# Altium schematic sheet Lilypad_Schematic_1.SchDoc
size A4
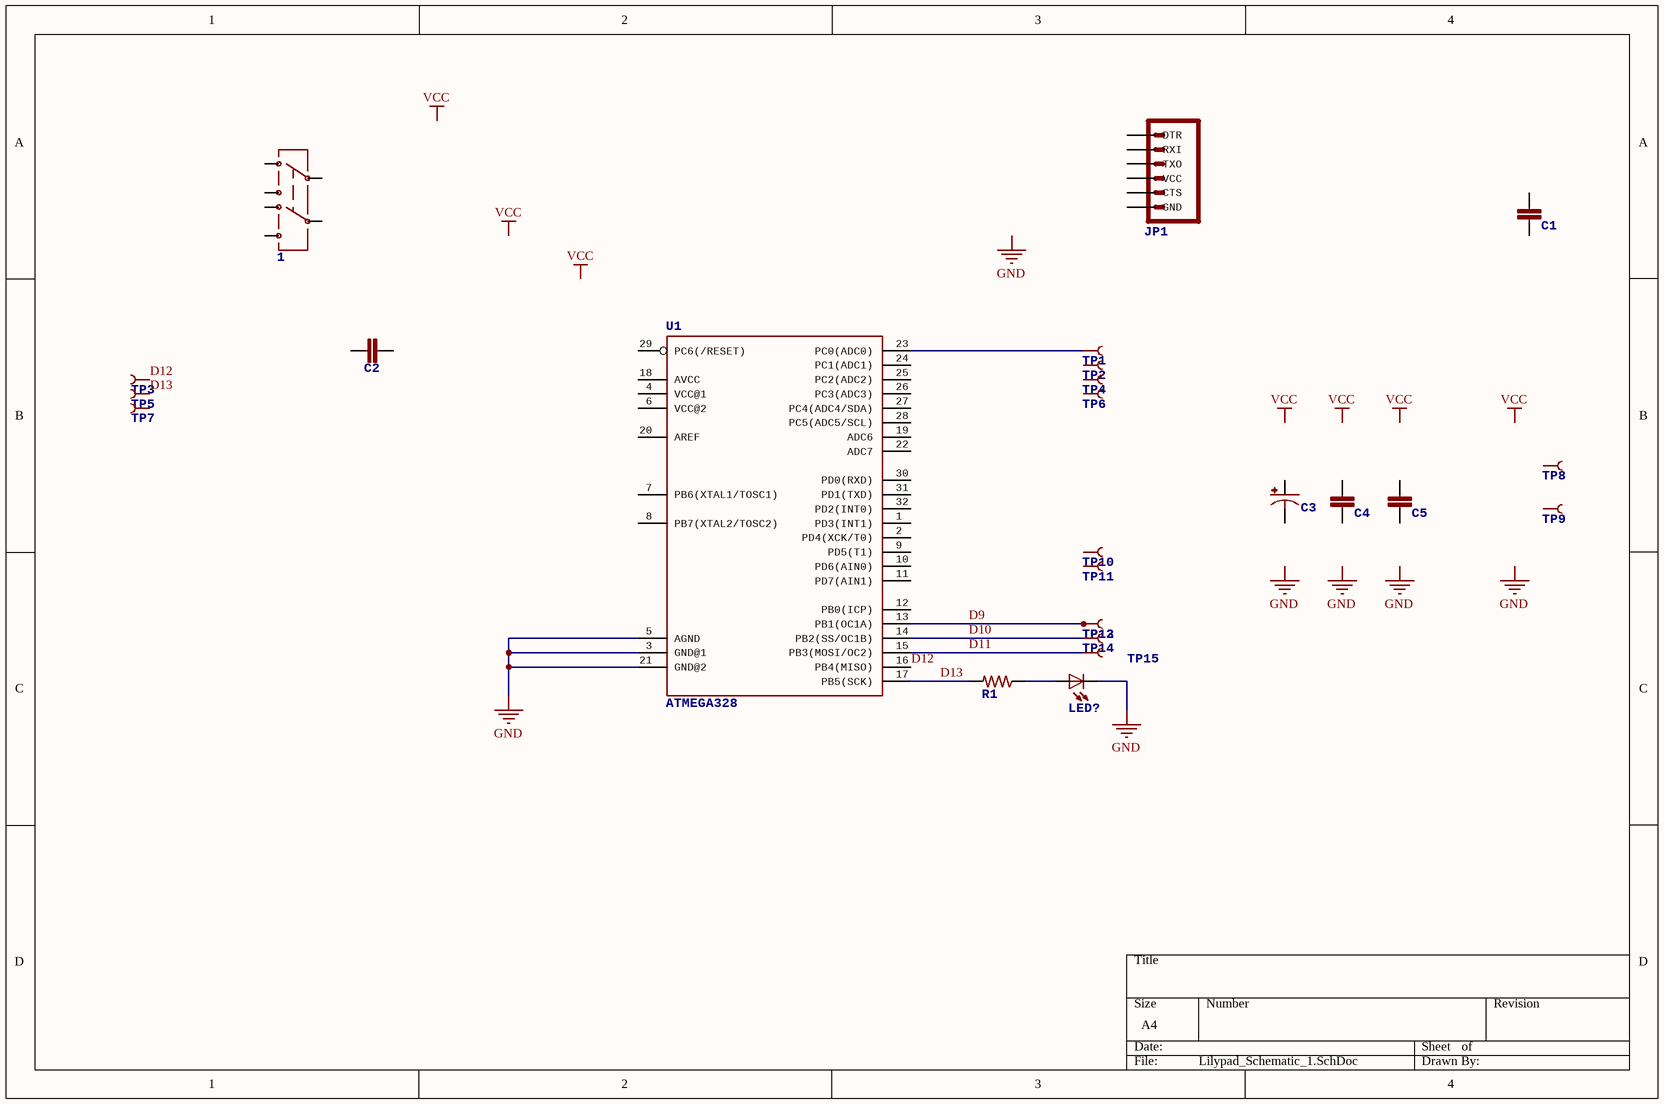
[diagram p0: Lilypad_Schematic_1.SchDoc]

## Parts
1  AYZ0202  [AYZ0202]  (value not drawn)
C1  CAP0402-CAP  [0402-CAP]  (value not drawn)
C2  CAP0402-CAP  [0402-CAP]  (value not drawn)
C3  CAP_POL3528  [EIA3528]  (value not drawn)
C4  CAP0402-CAP  [0402-CAP]  (value not drawn)
C5  CAP0402-CAP  [0402-CAP]  (value not drawn)
JP1  ARDUINO_SERIAL_PROGRAMSMD  [1X06-SMD]  (value not drawn)
LED?  LED0603  [LED-0603]  (value not drawn)
R1  RESISTOR0402-RES  [0402-RES]  (value not drawn)
TP1  CONN  [PETAL-LONG-2]  (value not drawn)
TP2  CONN  [PETAL-LONG-2]  (value not drawn)
TP3  CONN  [PETAL-LONG-2]  (value not drawn)
TP4  CONN  [PETAL-LONG-2]  (value not drawn)
TP5  CONN  [PETAL-LONG-2]  (value not drawn)
TP6  CONN  [PETAL-LONG-2]  (value not drawn)
TP7  CONN  [PETAL-LONG-2]  (value not drawn)
TP8  CONN  [PETAL-LONG-2]  (value not drawn)
TP9  CONN  [PETAL-LONG-2]  (value not drawn)
TP10  CONN  [PETAL-LONG-2]  (value not drawn)
TP11  CONN  [PETAL-LONG-2]  (value not drawn)
TP12  CONN  [PETAL-LONG-2]  (value not drawn)
TP13  CONN  [PETAL-LONG-2]  (value not drawn)
TP14  CONN  [PETAL-LONG-2]  (value not drawn)
TP15  CONN  [PETAL-LONG-2]  (value not drawn)
U1  ATMEGA328  [TQFP32-08]

## Nets
GND: LED?.C U1.3(GND@1) U1.5(AGND) U1.21(GND@2)
D9: TP12.1 TP13.1 U1.13(PB1(OC1A))
D10: TP14.1 U1.14(PB2(SS/OC1B))
D11: TP15.1 U1.15(PB3(MOSI/OC2))
D12: TP3.1 U1.16(PB4(MISO))
D13: R1.2 TP5.1 U1.17(PB5(SCK))
NetLED?_A: LED?.A R1.1
NetTP1_1: TP1.1 U1.23(PC0(ADC0))

Not connected (* = marked no-connect by the designer): 1 1(3) 2 3(1) 4(6) 5 6(4); C1 1 2; C2 1 2; C3 A(+) C(-); C4 1 2; C5 1 2; JP1 1(DTR) 2(RXI) 3(TXO) 4(VCC) 5(CTS) 6(GND); TP2 1; TP4 1; TP6 1; TP7 1; TP8 1; TP9 1; TP10 1; TP11 1; U1 1(PD3(INT1)) 2(PD4(XCK/T0)) 4(VCC@1) 6(VCC@2) 7(PB6(XTAL1/TOSC1)) 8(PB7(XTAL2/TOSC2)) 9(PD5(T1)) 10(PD6(AIN0)) 11(PD7(AIN1)) 12(PB0(ICP)) 18(AVCC) 19(ADC6) 20(AREF) 22(ADC7) 24(PC1(ADC1)) 25(PC2(ADC2)) 26(PC3(ADC3)) 27(PC4(ADC4/SDA)) 28(PC5(ADC5/SCL)) 29(PC6(/RESET)) 30(PD0(RXD)) 31(PD1(TXD)) 32(PD2(INT0))

## Notes on the sheet
- Labels drawn without touching a wire or pin: GND, VCC